# EAGLE design garden (EAGLE 7.7.0)
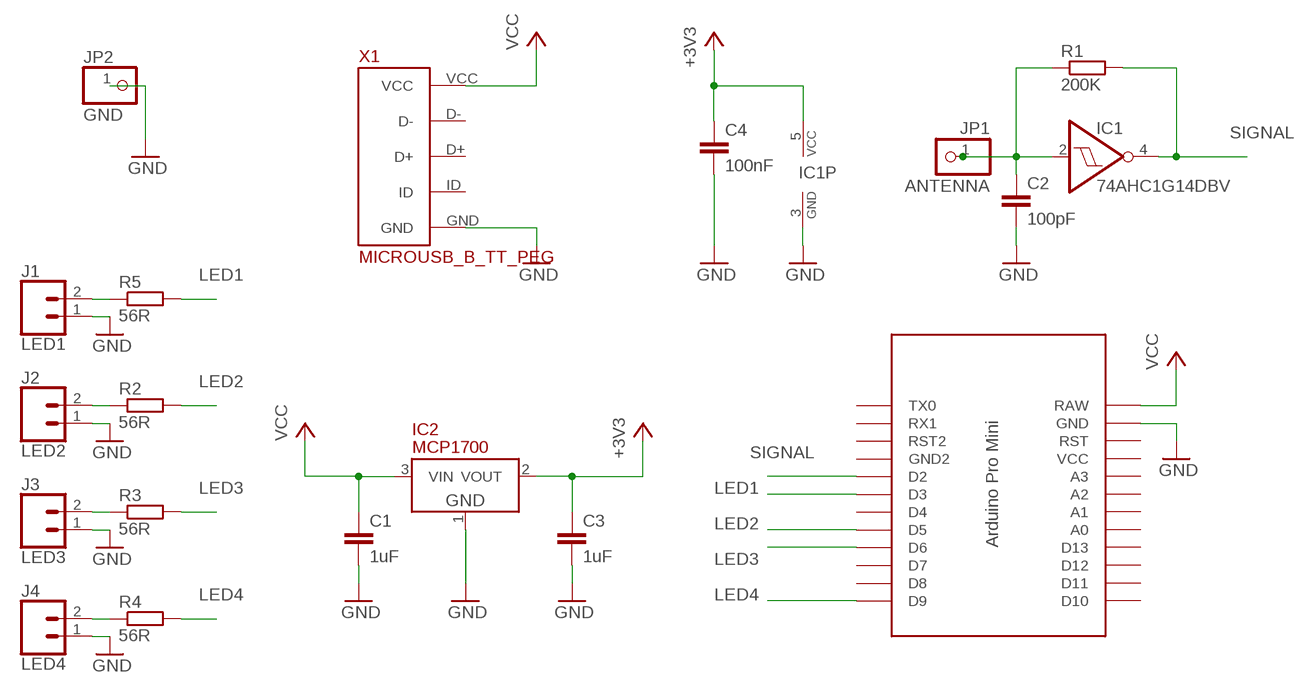
[diagram p0: schematic, sheet 1]

## Parts
C1  1uF  C-EUC0805  [C0805]
C2  100pF  C-EUC0805  [C0805]
C3  1uF  C-EUC0805  [C0805]
C4  100nF  C-EUC0805  [C0805]
IC1  74AHC1G14DBV  [SOT23-5]
IC2  MCP1700  [SOT-23]
J1  LED1  CONN_02  [1X02]
J2  LED2  CONN_02  [1X02]
J3  LED3  CONN_02  [1X02]
J4  LED4  CONN_02  [1X02]
JP1  ANTENNA  PINHD-1X1  [1X01]
JP2  GND  PINHD-1X1  [1X01]
R1  200K  R-EU_R0805  [R0805]
R2  56R  R-EU_M0805  [M0805]
R3  56R  R-EU_M0805  [M0805]
R4  56R  R-EU_M0805  [M0805]
R5  56R  R-EU_M0805  [M0805]
U$1  PRO-MINI-TWO-SIDES-ONLY  [PRO-MINI-TWO-SIDES-ONLY]
X1  MICROUSB_B_TT_PEG  [MICROUSB_B_TT_PEG]

## Nets
+3V3 [vcc]: C3.1 C4.1 IC1.5(VCC) IC2.2(VOUT)
ANTENNA: C2.1 IC1.2(I) JP1.1 R1.1
GND: C1.2 C2.2 C3.2 C4.2 IC1.3(GND) IC2.1(GND) J1.1 J2.1 J3.1 J4.1 JP2.1 U$1.GND X1.GND
LED1: R5.2 U$1.D3
LED2: R2.2 U$1.D5
LED3: R3.2 U$1.D6
LED4: R4.2 U$1.D9
N$1: J1.2 R5.1
N$2: J2.2 R2.1
N$3: J3.2 R3.1
N$4: J4.2 R4.1
SIGNAL: IC1.4(O) R1.2 U$1.D2
VCC [vcc]: C1.1 IC2.3(VIN) U$1.RAW X1.VCC
Unconnected: U$1.A0 U$1.A1 U$1.A2 U$1.A3 U$1.D4 U$1.D7 U$1.D8 U$1.D10 U$1.D11 U$1.D12 U$1.D13 U$1.GND1(GND2) U$1.RST U$1.RST1(RST2) U$1.RX1 U$1.TX0 U$1.VCC X1.D+ X1.D- X1.ID

## Library data of the parts
C1-C4 = rcl:C-EU: CAPACITOR, European symbol
IC1 = 74xx-little-de:74*1G14: Single Schmitt-Trigger Inverter Gate
IC2 = laszlo_eagle:MCP1700: Low Quiescent Current LDO
J1-J4 = SparkFun-Connectors:CONN_02: Multi connection point. Often used as Generic Header-pin footprint for 0.1 inch spaced/style header connections On any of the 0.1 inch spaced packages, you can populate with these: Break Away Headers - Straight <https://www.sparkfun.com/products/116> (PRT-00116) Break Away Male Headers - Right Angle <https://www.sparkfun.com/products/553> (PRT-00553) Female Headers <https://www.sparkfun.com/products/115> (PRT-00115) Break Away Headers - Machine Pin <https://www.sparkfun.com/products/117> (PRT-00117) Break Away Female Headers - Swiss Machine Pin <https://www.sparkfun.com/products/743> (PRT-00743) For SCREWTERMINALS and SPRING TERMINALS visit here: Screw Terimnals on SparkFun.com <https://www.sparkfun.com/search/results?term=Screw+Terminals> (5mm/3.5mm/2.54mm spacing) This device is also useful as a general connection point to wire up your design to another part of your project. Our various solder wires solder well into these plated through hole pads. Hook-Up Wire - Assortment (Stranded, 22 AWG) <https://www.sparkfun.com/products/11375> (PRT-11375) Hook-Up Wire - Assortment (Solid Core, 22 AWG) <https://www.sparkfun.com/products/11367> (PRT-11367) View the entire wire category on our website here <https://www.sparkfun.com/categories/141> Special notes: Molex polarized connector foot print use with: PRT-08233 with associated crimp pins and housings. 2.54_SCREWTERM for use with PRT-10571. 3.5mm Screw Terminal footprints for PRT-08084 5mm Screw Terminal footprints for use with PRT-08432
JP1 JP2 = pinhead:PINHD-1X1: PIN HEADER
R1 = resistor:R-EU_: RESISTOR, European symbol
R2-R5 = rcl:R-EU_: RESISTOR, European symbol
U$1 = Arduino-clone:PRO-MINI-TWO-SIDES-ONLY
X1 = laszlo_eagle:MICROUSB_B_TT_PEG

## Net classes
0 default: width 0.203 mm
1 vcc: width 0.254 mm

## Board
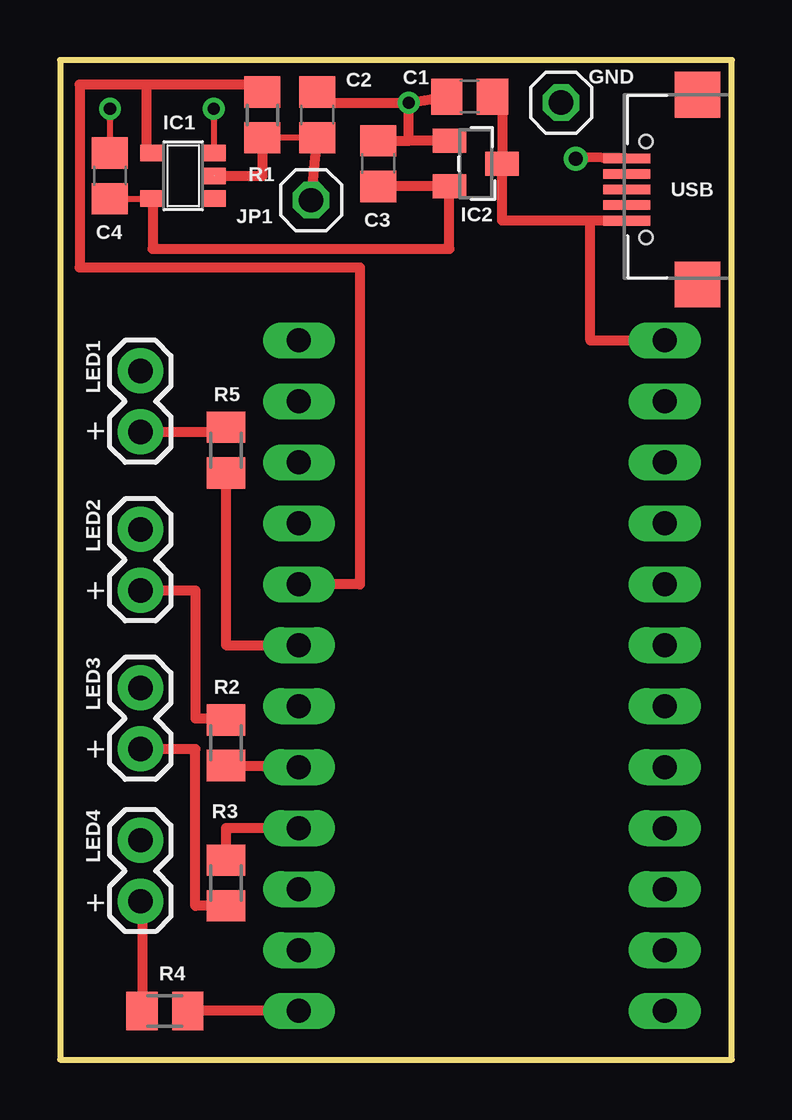
[diagram p1: board, top side]
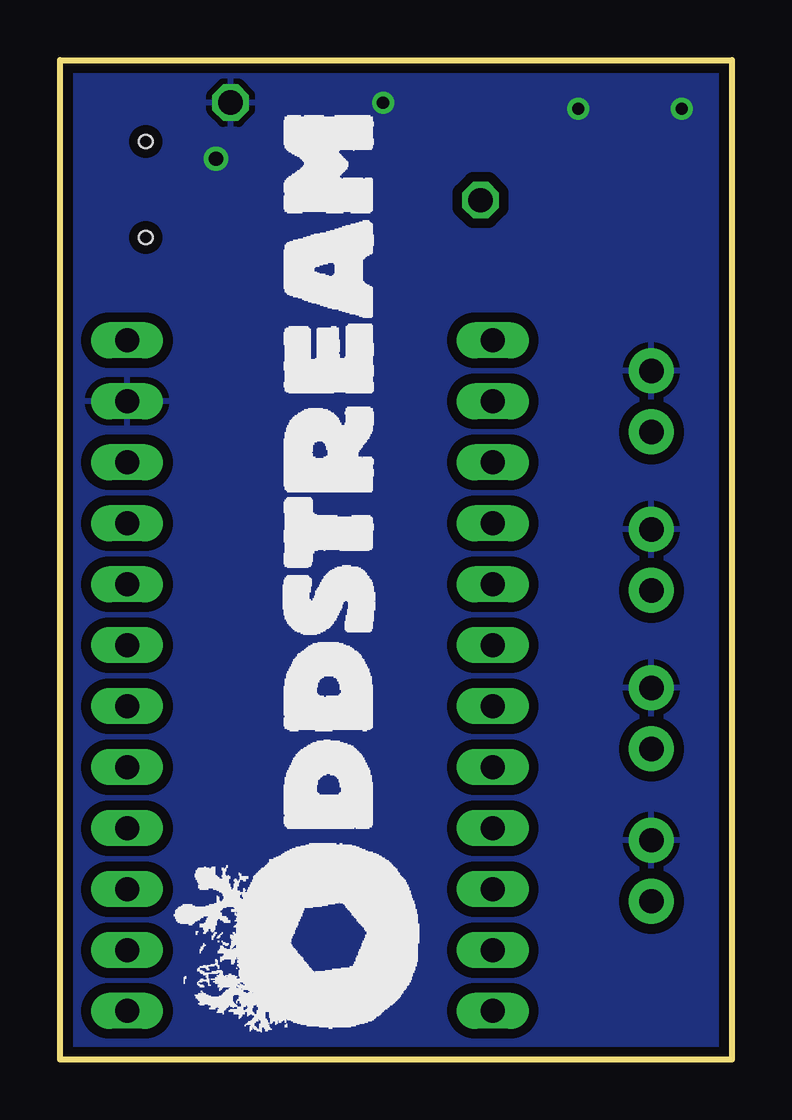
[diagram p2: board, bottom side, seen from below]

Size 27.99 x 41.66 mm. Coordinates in mm from the lower left corner, seen from the top.
Outline: 0,41.66 0,0 27.99,0 27.99,41.66 0,41.66
Copper layers (1*16): Top 0.035mm / dielectric 1.5mm / Bottom 0.035mm
Design rules "default *": minimum track width 10mil, minimum drill 20mil, track to track 8mil, track to pad 8mil, pad to pad 8mil, via to via 8mil, smd to smd 8mil, copper to edge 8mil, drill to drill 8mil, minimum pad ring 10mil, minimum via ring 8mil, stop-mask expansion 4mil, vias tented up to drill 0mil, thermal gap 10mil

### Footprints (pad centres in the part's own frame; a part is rotated, then mirrored left to right if it is on the bottom)
C0805 = smd 1.3 x 1.5: 1 -0.95,0; 2 0.95,0
SOT23-5 = smd 0.69 x 0.99: 1 -0.95,-1.29; 2 0,-1.29; 3 0.95,-1.29; 4 0.95,1.3; 5 -0.95,1.3
SOT-23 = smd 1 x 1.4: 1 -0.95,-1.1; 2 0.95,-1.1; 3 0,1.1
1X02 = drill 1.016 pad 1.88: 1 0,0; 2 2.54,0
1X01 = drill 1.016 octagon: 1 0,0
R0805 = smd 1.3 x 1.5: 1 -0.95,0; 2 0.95,0
M0805 = smd 1.3 x 1.6: 1 -0.95,0; 2 0.95,0
PRO-MINI-TWO-SIDES-ONLY = drill 1 long: A0 8.89,8.89; A1 8.89,11.43; A2 8.89,13.97; A3 8.89,16.51; D2 -6.35,16.51; D3 -6.35,13.97; D4 -6.35,11.43; D5 -6.35,8.89; D6 -6.35,6.35; D7 -6.35,3.81; D8 -6.35,1.27; D9 -6.35,-1.27; D10 8.89,-1.27; D11 8.89,1.27; D12 8.89,3.81; D13 8.89,6.35; GND 8.89,24.13; GND1 -6.35,19.05; RAW 8.89,26.67; RST 8.89,21.59; RST1 -6.35,21.59; RX1 -6.35,24.13; TX0 -6.35,26.67; VCC 8.89,19.05
MICROUSB_B_TT_PEG = smd 0.4 x 1.95: D+ -3.95,-2.95; D- -3.3,-2.95; GND -5.25,-2.95; ID -4.6,-2.95; VCC -2.65,-2.95 | smd 1.9 x 1.9: P$1 0,0; P$2 -7.9,0 | hole 0.55: -1.95,-2.15; -5.95,-2.15

### Placement (x,y rotation side)
C1  17.07,40.13 180 top
C2  10.72,39.37 90 top
C3  13.26,37.34 90 top
C4  2.08,36.83 90 top
IC1  5.13,36.83 90 top
IC2  17.32,37.34 270 top
J1  3.35,28.7 270 top
J2  3.35,22.1 270 top
J3  3.35,15.49 270 top
J4  3.35,9.14 270 top
JP1  10.46,35.81 0 top
JP2  20.88,39.88 0 top
R1  8.43,39.37 90 top
R2  6.91,13.21 270 top
R3  6.91,7.37 90 top
R4  4.37,2.03 0 top
R5  6.91,25.4 270 top
U$1  16.31,3.3 0 top
X1  26.57,32.31 270 top

### Tracks (layer width: path | path; a pad name or v marks a point on that pad's centre or on a via)
+3V3
  Top 0.254: 3.86,35.85 IC1.5 C4.1
  Top 0.406: C3.1 IC2.2 16.22,33.78 3.86,33.78 3.86,35.85
ANTENNA
  Top 0.254: C2.1 R1.1
  Top 0.406: R1.1 8.43,36.83 IC1.2 | 10.72,38.35 C2.1 JP1.1
GND  (via drill 0.51, 0.6)
  Top 0.254: v2.08,39.62 C4.2 | v6.4,39.62 6.4,37.8 IC1.3
  Top 0.406: 13.77,38.29 13.77,38.35 | 16.31,38.35 16.31,38.29 IC2.1 14.53,38.29 | 13,38.35 13,38.29 C3.2 13.77,38.29 | 13.77,38.29 14.53,38.29 | 14.53,38.29 v14.53,39.88 | v14.53,39.88 C1.2 | C2.2 10.72,39.88 v14.53,39.88 | X1.GND 21.49,37.61 v21.49,37.54
  pour Bottom (isolate 0.406): 0,41.66 0,0 27.99,0 27.99,41.66
LED1
  Top 0.406: R5.2 6.91,17.27 U$1.D3
LED2
  Top 0.406: R2.2 9.96,12.26 U$1.D5
LED3
  Top 0.406: U$1.D6 6.91,9.65 R3.2
LED4
  Top 0.406: U$1.D9 R4.2
N$1
  Top 0.406: J1.2 6.91,26.16 R5.1
N$2
  Top 0.406: R2.1 7.16,14.22 5.64,14.22 5.64,19.56 J2.2
N$3
  Top 0.406: R3.1 5.64,6.42 5.64,12.95 J3.2
N$4
  Top 0.406: J4.2 3.42,6.86 R4.1
SIGNAL
  Top 0.254: 3.86,37.81 IC1.4
  Top 0.406: 3.61,40.64 0.81,40.64 0.81,33.02 12.5,33.02 12.5,19.81 U$1.D2 | 3.61,40.64 8.18,40.64 R1.2 | 3.86,37.81 3.61,37.81 3.61,40.64
VCC
  Top 0.406: U$1.RAW 22.1,29.97 22.1,34.96 | C1.1 18.42,40.13 IC2.3 18.42,34.96 22.1,34.96 | X1.VCC 22.1,34.96

### Text on the board
tNames: USB | + | + | + | +